# EAGLE design current (EAGLE 9.5.0)
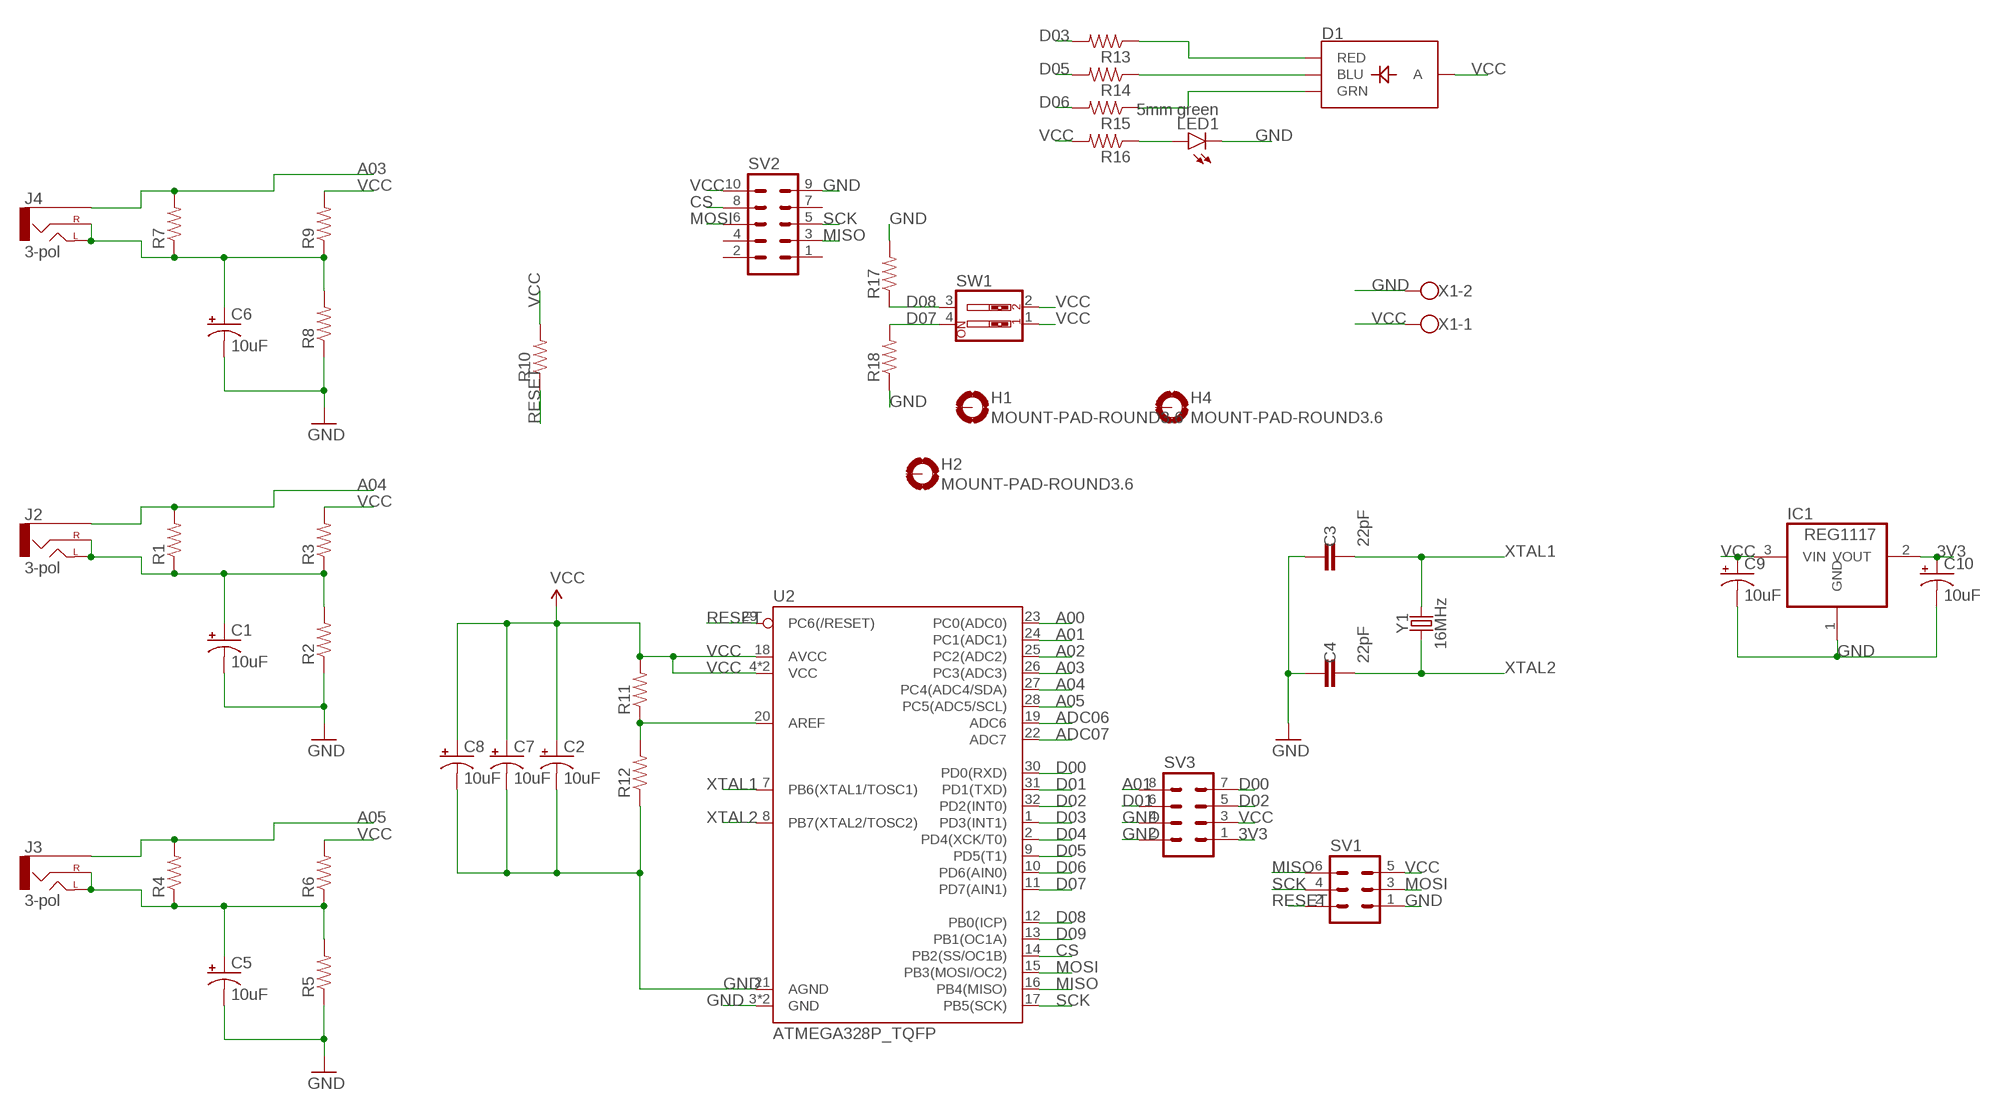
[diagram p0: schematic, sheet 1]

## Parts
C1  10uF  10UF-POLAR-EIA3216-16V-10%(TANT)  [EIA3216]
C2  10uF  10UF-POLAR-EIA3216-16V-10%(TANT)  [EIA3216]
C3  22pF  CAP-0805  [0805]
C4  22pF  CAP-0805  [0805]
C5  10uF  10UF-POLAR-EIA3216-16V-10%(TANT)  [EIA3216]
C6  10uF  10UF-POLAR-EIA3216-16V-10%(TANT)  [EIA3216]
C7  10uF  10UF-POLAR-EIA3216-16V-10%(TANT)  [EIA3216]
C8  10uF  10UF-POLAR-EIA3216-16V-10%(TANT)  [EIA3216]
C9  10uF  10UF-POLAR-EIA3216-16V-10%(TANT)  [EIA3216]
C10  10uF  10UF-POLAR-EIA3216-16V-10%(TANT)  [EIA3216]
D1  LED-RGB-CASMD  [LED-TRICOLOR-SMD]
H1  MOUNT-PAD-ROUND3.6  [3,6-PAD]
H2  MOUNT-PAD-ROUND3.6  [3,6-PAD]
H4  MOUNT-PAD-ROUND3.6  [3,6-PAD]
IC1  REG1117  [SOT223]
J2  3-pol  AUDIO-JACKPTH  [AUDIO-JACK]
J3  3-pol  AUDIO-JACKPTH  [AUDIO-JACK]
J4  3-pol  AUDIO-JACKPTH  [AUDIO-JACK]
LED1  5mm green  LEDCHIPLED_0805  [CHIPLED_0805]
R1  RESISTOR0805  [0805]
R2  RESISTOR0805  [0805]
R3  RESISTOR0805  [0805]
R4  RESISTOR0805  [0805]
R5  RESISTOR0805  [0805]
R6  RESISTOR0805  [0805]
R7  RESISTOR0805  [0805]
R8  RESISTOR0805  [0805]
R9  RESISTOR0805  [0805]
R10  RESISTOR0805  [0805]
R11  RESISTOR0805  [0805]
R12  RESISTOR0805  [0805]
R13  RESISTOR0805  [0805]
R14  RESISTOR0805  [0805]
R15  RESISTOR0805  [0805]
R16  RESISTOR0805  [0805]
R17  RESISTOR0805  [0805]
R18  RESISTOR0805  [0805]
SV1  MA03-2  [MA03-2]
SV2  MA05-2  [MA05-2]
SV3  MA04-2  [MA04-2]
SW1  SW_DIP-2  [EDG-02]
U2  ATMEGA328P_TQFP  [TQFP32-08]
X1  W237-102  [W237-102]
Y1  16MHz  CRYSTALSMD-3.2X2.5  [CRYSTAL-SMD-3.2X2.5MM]

## Nets
3V3: C10.+ IC1.2(VOUT) SV3.1
A00: U2.23(PC0(ADC0))
A01: SV3.8 U2.24(PC1(ADC1))
A02: U2.25(PC2(ADC2))
A03: J4.SLEEVE R7.2 U2.26(PC3(ADC3))
A04: J2.SLEEVE R1.2 U2.27(PC4(ADC4/SDA))
A05: J3.SLEEVE R4.2 U2.28(PC5(ADC5/SCL))
ADC06: U2.19(ADC6)
ADC07: U2.22(ADC7)
CS: SV2.8 U2.14(PB2(SS/OC1B))
D00: SV3.7 U2.30(PD0(RXD))
D01: SV3.6 U2.31(PD1(TXD))
D02: SV3.5 U2.32(PD2(INT0))
D03: R13.2 U2.1(PD3(INT1))
D04: U2.2(PD4(XCK/T0))
D05: R14.2 U2.9(PD5(T1))
D06: R15.2 U2.10(PD6(AIN0))
D07: R18.2 SW1.4 U2.11(PD7(AIN1))
D08: R17.1 SW1.3 U2.12(PB0(ICP))
D09: U2.13(PB1(OC1A))
GND: C1.- C2.- C3.1 C4.1 C5.- C6.- C7.- C8.- C9.- C10.- IC1.1(GND) LED1.C R2.1 R5.1 R8.1 R12.1 R17.2 R18.1 SV1.1 SV2.9 SV3.2 SV3.4 U2.3(GND) U2.5(GND) U2.21(AGND) X1.2
MISO: SV1.6 SV2.3 U2.16(PB4(MISO))
MOSI: SV1.3 SV2.6 U2.15(PB3(MOSI/OC2))
N$1: C5.+ J3.RING(RIGHT) J3.TIP(LEFT) R4.1 R5.2 R6.1
N$2: C1.+ J2.RING(RIGHT) J2.TIP(LEFT) R1.1 R2.2 R3.1
N$3: C6.+ J4.RING(RIGHT) J4.TIP(LEFT) R7.1 R8.2 R9.1
N$4: D1.R(RED) R13.1
N$5: R11.1 R12.2 U2.20(AREF)
N$6: D1.B(BLU) R14.1
N$7: D1.G(GRN) R15.1
N$8: LED1.A R16.1
RESET: R10.1 SV1.2 U2.29(PC6(/RESET))
SCK: SV1.4 SV2.5 U2.17(PB5(SCK))
VCC: C2.+ C7.+ C8.+ C9.+ D1.A IC1.3(VIN) R3.2 R6.2 R9.2 R10.2 R11.2 R16.2 SV1.5 SV2.10 SV3.3 SW1.1 SW1.2 U2.4(VCC) U2.6(VCC) U2.18(AVCC) X1.1
XTAL1: C3.2 U2.7(PB6(XTAL1/TOSC1)) Y1.3
XTAL2: C4.2 U2.8(PB7(XTAL2/TOSC2)) Y1.1
Unconnected: H1.B3,6(MOUNT) H2.B3,6(MOUNT) H4.B3,6(MOUNT) SV2.1 SV2.2 SV2.4 SV2.7

## Library data of the parts
C1 C2 C5-C10 = SparkFun-Capacitors:10UF-POLAR: 10.0µF polarized capacitors A capacitor is a passive two-terminal electrical component used to store electrical energy temporarily in an electric field.; PROD_ID: CAP-00811
C3 C4 = SparkFun-Capacitors:CAP
D1 = SparkFun-LED:LED-RGB-CA: LED-RGB Diffused Common Anode Packages: LED RGB-THRU P-LCC-4-3 LED-TRICOLOR-SMD SparkFun Products: RGB Diffused Common Anode- Diffuse <[https://www.sparkfun.com/products/10821]> RGB Diffused Common Anode - Clear <[https://www.sparkfun.com/products/10820]> Qduino Mini <[https://www.sparkfun.com/products/13614]> Triple Output LED RGB - SMD <https://www.sparkfun.com/products/7844>; PROD_ID: DIO-08324
H1 H2 H4 = holes:MOUNT-PAD-ROUND: MOUNTING PAD, round
IC1 = burr-brown:REG1117: 800mA and 1A Low Dropout (LDO) Positive Regulator 1.8V, 2.5V, 2.85V, 3.3V, 5V, and Adj; MPN: REG1117; OC_FARNELL: 1097566; OC_NEWARK: 14P6981
J2-J4 = SparkFun-Connectors:AUDIO-JACK: 3.5mm Audio Jack Simple 3.5mm common PCB mount audio jack. Variant PTH is our storefront SKU PRT-08032
LED1 = led:LED: LED OSRAM: - CHIPLED LG R971, LG N971, LY N971, LG Q971, LY Q971, LO R971, LY R971 LH N974, LH R974 LS Q976, LO Q976, LY Q976 LO Q996 - Hyper CHIPLED LW Q18S LB Q993, LB Q99A, LB R99A - SideLED LS A670, LO A670, LY A670, LG A670, LP A670 LB A673, LV A673, LT A673, LW A673 LH A674 LY A675 LS A676, LA A676, LO A676, LY A676, LW A676 LS A679, LY A679, LG A679 - Hyper Micro SIDELED® LS Y876, LA Y876, LO Y876, LY Y876 LT Y87S - SmartLED LW L88C, LW L88S LB L89C, LB L89S, LG L890 LS L89K, LO L89K, LY L89K LS L896, LA L896, LO L896, LY L896 - TOPLED LS T670, LO T670, LY T670, LG T670, LP T670 LSG T670, LSP T670, LSY T670, LOP T670, LYG T670 LG T671, LOG T671, LSG T671 LB T673, LV T673, LT T673, LW T673 LH T674 LS T676, LA T676, LO T676, LY T676, LB T676, LH T676, LSB T676, LW T676 LB T67C, LV T67C, LT T67C, LS T67K, LO T67K, LY T67K, LW E67C LS E67B, LA E67B, LO E67B, LY E67B, LB E67C, LV E67C, LT E67C LW T67C LS T679, LY T679, LG T679 LS T770, LO T770, LY T770, LG T770, LP T770 LB T773, LV T773, LT T773, LW T773 LH T774 LS E675, LA E675, LY E675, LS T675 LS T776, LA T776, LO T776, LY T776, LB T776 LHGB T686 LT T68C, LB T68C - Hyper Mini TOPLED® LB M676 - Mini TOPLED Santana® LG M470 LS M47K, LO M47K, LY M47K Source: http://www.osram.convergy.de LUXEON: - LUMILED® LXK2-PW12-R00, LXK2-PW12-S00, LXK2-PW14-U00, LXK2-PW14-V00 LXK2-PM12-R00, LXK2-PM12-S00, LXK2-PM14-U00 LXK2-PE12-Q00, LXK2-PE12-R00, LXK2-PE12-S00, LXK2-PE14-T00, LXK2-PE14-U00 LXK2-PB12-K00, LXK2-PB12-L00, LXK2-PB12-M00, LXK2-PB14-N00, LXK2-PB14-P00, LXK2-PB14-Q00 LXK2-PR12-L00, LXK2-PR12-M00, LXK2-PR14-Q00, LXK2-PR14-R00 LXK2-PD12-Q00, LXK2-PD12-R00, LXK2-PD12-S00 LXK2-PH12-R00, LXK2-PH12-S00 LXK2-PL12-P00, LXK2-PL12-Q00, LXK2-PL12-R00 Source: www.luxeon.com KINGBRIGHT: KA-3528ASYC Source: www.kingbright.com
R1-R18 = SparkFun-Resistors:RESISTOR: Generic Resistor Package
SV1 = con-lstb:MA03-2: PIN HEADER; OC_FARNELL: unknown; OC_NEWARK: unknown
SV2 = con-lstb:MA05-2: PIN HEADER; OC_FARNELL: unknown; OC_NEWARK: unknown
SV3 = con-lstb:MA04-2: PIN HEADER; OC_FARNELL: unknown; OC_NEWARK: unknown
SW1 = special:SW_DIP-2: DIP SWITCH
U2 = escape:ATMEGA328P_TQFP: Popular 328P in QFP Storefront component: ATmega328 - TQFP <https://www.sparkfun.com/products/13448> (COM-13448) Datasheet <http://www.sparkfun.com/datasheets/Components/SMD/ATMega328.pdf> SparkFun Products SparkFun RedBoard - Programmed with Arduino <https://www.sparkfun.com/products/12757> (DEV-12757) Arduino Pro Mini 328 - 5V/16MHz <https://www.sparkfun.com/products/11113> (DEV-11113) Arduino Pro Mini 328 - 3.3V/8MHz <https://www.sparkfun.com/products/11114> (DEV-11114) SparkFun OpenLog <https://www.sparkfun.com/products/13712> (DEV-13712) SparkFun MicroView - OLED Arduino Module <https://www.sparkfun.com/products/12923> (DEV-12923) SparkFun Digital Sandbox <https://www.sparkfun.com/products/12651> (DEV-12651) SparkFun PicoBoard <https://www.sparkfun.com/products/11888> (WIG-11888) Arduino Fio <https://www.sparkfun.com/products/10116> (DEV-10116) LilyPad Arduino 328 Main Board <https://www.sparkfun.com/products/13342> (DEV-13342) SparkFun RedStick <https://www.sparkfun.com/products/13741> (DEV-13741) LilyPad MP3 <https://www.sparkfun.com/products/11013> (DEV-11013) LilyPad Arduino SimpleSnap <https://www.sparkfun.com/products/10941> (DEV-10941) SparkFun Stepoko <https://www.sparkfun.com/products/13899> (ROB-13899) SparkFun Geiger Counter <https://www.sparkfun.com/products/11345> (SEN-11345) SparkFun EL Sequencer <https://www.sparkfun.com/products/12781> (COM-12781) Arduino Pro 328 - 5V/16MHz <https://www.sparkfun.com/products/10915> (DEV-10915) CryptoCape <https://www.sparkfun.com/products/12773> (DEV-12773) SparkFun IR Thermometer Evaluation Board - MLX90614 <https://www.sparkfun.com/products/10740> (SEN-10740) SparkFun RedBot Mainboard <https://www.sparkfun.com/products/12097> (ROB-12097) Arduino Pro 328 - 3.3V/8MHz <https://www.sparkfun.com/products/10914> (DEV-10914) SparkFun Block for Intel® Edison - Arduino <https://www.sparkfun.com/products/13036> (DEV-13036) SparkFun Simon Says - Surface Mount Soldering Kit <https://www.sparkfun.com/products/10935> (KIT-10935) SparkFun 7-Segment Serial Display - Red <https://www.sparkfun.com/products/11441> (COM-11441) SparkFun 7-Segment Serial Display - White <https://www.sparkfun.com/products/11629> (COM-11629) SparkFun 7-Segment Serial Display - Yellow <https://www.sparkfun.com/products/11443> (COM-11443) SparkFun 7-Segment Serial Display - Kelly Green <https://www.sparkfun.com/products/11440> (COM-11440) SparkFun 7-Segment Serial Display - Blue <https://www.sparkfun.com/products/11442> (COM-11442) SparkFun OpenSegment Serial Display - 20mm (Blue) <https://www.sparkfun.com/products/11647> (COM-11647) SparkFun OpenSegment Serial Display - 20mm (Green) <https://www.sparkfun.com/products/11646> (COM-11646) SparkFun OpenSegment Serial Display - 20mm (White) <https://www.sparkfun.com/products/11648> (COM-11648) SparkFun OpenSegment Serial Display - 20mm (Red) <https://www.sparkfun.com/products/11644> (COM-11644) SparkFun OpenSegment Serial Display - 20mm (Yellow) <https://www.sparkfun.com/products/11645> (COM-11645) SparkFun OpenSegment Shield <https://www.sparkfun.com/products/13190> (DEV-13190); PROD_ID: IC-09069
X1 = con-wago-500:W237-102: WAGO SCREW CLAMP; MPN: 237-102; OC_FARNELL: unknown; OC_NEWARK: 70K9898
Y1 = SparkFun-Clocks:CRYSTAL: Crystals (Generic) These are passive quartz crystals, which can be used as a clock source for a microcontroller. Crystal's are two-terminal devices. They require external "load" capacitors to generate an oscillating signal.

## Board
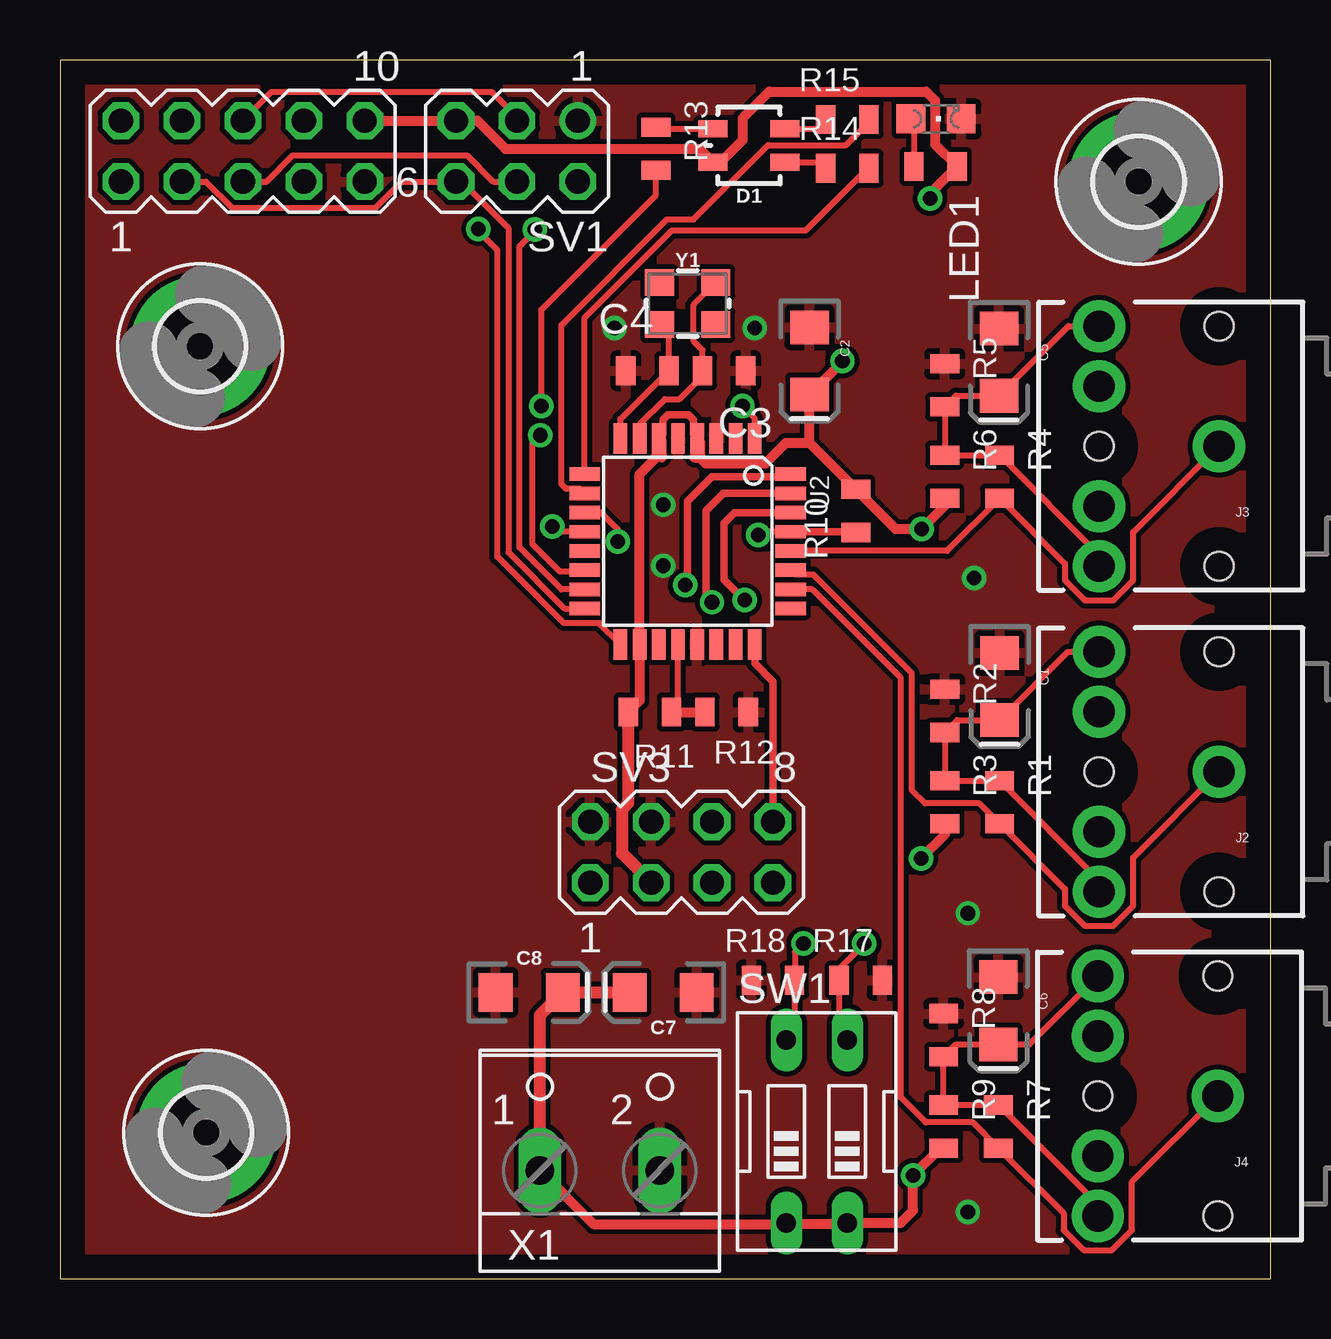
[diagram p1: board, top side]
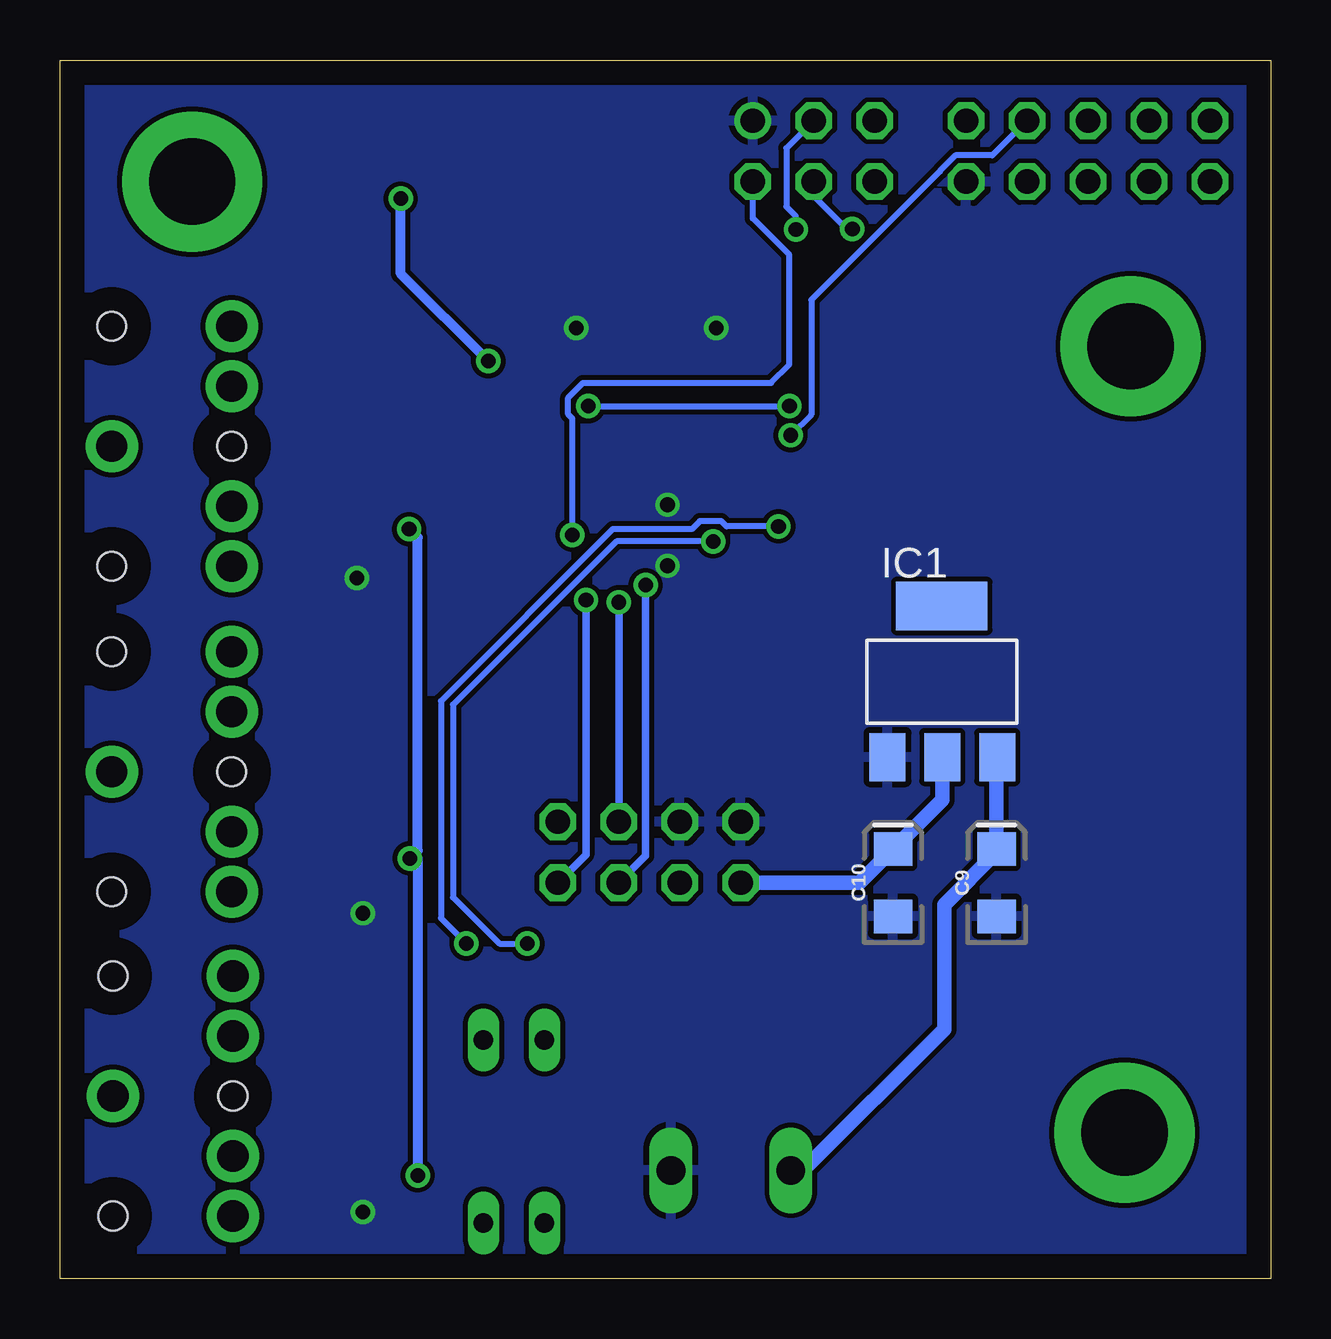
[diagram p2: board, bottom side, seen from below]

Size 50.47 x 50.79 mm. Coordinates in mm from the lower left corner, seen from the top.
Outline: 0,0 50.47,0 50.47,50.79 0,50.79 0,0
Copper layers (1*16): Top 0.035mm / dielectric 1.5mm / Bottom 0.035mm
Design rules "default": minimum track width 10mil, minimum drill 24mil, track to track 8mil, track to pad 8mil, pad to pad 8mil, via to via 8mil, smd to smd 8mil, copper to edge 40mil, drill to drill 8mil, minimum pad ring 10mil, minimum via ring 8mil, stop-mask expansion 4mil, vias tented up to drill 0mil, thermal gap 10mil

### Footprints (pad centres in the part's own frame; a part is rotated, then mirrored left to right if it is on the bottom)
EIA3216 = smd 1.4 x 1.6: + 1.4,0; - -1.4,0
0805 = smd 0.8 x 1.2: 1 -0.9,0; 2 0.9,0
LED-TRICOLOR-SMD = smd 1.2 x 0.7: A 1.5,0.7; B -1.5,0.7; G -1.5,-0.7; R 1.5,-0.7
3,6-PAD = drill 3.6 pad 5.842: B3,6 0,0
SOT223 = smd 1.499 x 2.007: 1 -2.261,-3.15; 2 0.025,-3.15; 3 2.311,-3.15 | smd 3.81 x 2.007: 4 0,3.15
AUDIO-JACK = drill 1.3 pad 2.184: RING 5,5; RSH 5,2.5; SLEEVE 0,0; TIP 5,-5; TSH 5,-2.5 | hole 1.2: 0,5; 0,-5; 5,0
CHIPLED_0805 = smd 1.2 x 1.2: A 0,-1.05; C 0,1.05
MA03-2 = drill 1.016: 1 -2.54,-1.27 | drill 1.016 octagon: 2 -2.54,1.27; 3 0,-1.27; 4 0,1.27; 5 2.54,-1.27; 6 2.54,1.27
MA05-2 = drill 1.016 octagon: 1 -5.08,-1.27; 2 -5.08,1.27; 3 -2.54,-1.27; 4 -2.54,1.27; 5 0,-1.27; 6 0,1.27; 7 2.54,-1.27; 8 2.54,1.27; 9 5.08,-1.27; 10 5.08,1.27
MA04-2 = drill 1.016 octagon: 1 -3.81,-1.27; 2 -3.81,1.27; 3 -1.27,-1.27; 4 -1.27,1.27; 5 1.27,-1.27; 6 1.27,1.27; 7 3.81,-1.27; 8 3.81,1.27
EDG-02 = drill 0.813 long: 1 -1.27,-3.81; 2 1.27,-3.81; 3 1.27,3.81; 4 -1.27,3.81
TQFP32-08 = smd 1.27 x 0.559: 1 -4.293,2.8; 2 -4.293,2; 3 -4.293,1.2; 4 -4.293,0.4; 5 -4.293,-0.4; 6 -4.293,-1.2; 7 -4.293,-2; 8 -4.293,-2.8; 17 4.293,-2.8; 18 4.293,-2; 19 4.293,-1.2; 20 4.293,-0.4; 21 4.293,0.4; 22 4.293,1.2; 23 4.293,2; 24 4.293,2.8 | smd 0.559 x 1.27: 9 -2.8,-4.293; 10 -2,-4.293; 11 -1.2,-4.293; 12 -0.4,-4.293; 13 0.4,-4.293; 14 1.2,-4.293; 15 2,-4.293; 16 2.8,-4.293; 25 2.8,4.293; 26 2,4.293; 27 1.2,4.293; 28 0.4,4.293; 29 -0.4,4.293; 30 -1.2,4.293; 31 -2,4.293; 32 -2.8,4.293
W237-102 = drill 1.194 long: 1 -2.5,-1.27; 2 2.5,-1.27
CRYSTAL-SMD-3.2X2.5MM = smd 1.2 x 1.1: 1 -1.175,-0.875; 2 1.175,-0.875; 3 1.175,0.875; 4 -1.175,0.875

### Placement (x,y rotation side)
C1  39.17,24.69 270 top
C2  31.24,38.25 270 top
C3  27.69,37.85 180 top
C4  24.49,37.85 0 top
C5  39.14,38.2 270 top
C6  39.12,11.18 270 top
C7  25.15,11.94 180 top
C8  19.56,11.94 0 top
C9  11.43,16.51 90 bottom
C10  15.75,16.51 90 bottom
D1  28.72,47.23 180 top
H1  44.96,45.72 0 top
H2  5.84,38.86 0 top
H4  6.1,6.1 0 top
IC1  13.72,24.89 0 bottom
J2  48.31,21.13 180 top
J3  48.31,34.7 180 top
J4  48.26,7.62 180 top
LED1  36.52,48.34 270 top
R1  39.17,19.86 270 top
R2  36.88,23.67 270 top
R3  36.88,19.86 270 top
R4  39.17,33.43 270 top
R5  36.88,37.24 270 top
R6  36.88,33.43 270 top
R7  39.12,6.35 270 top
R8  36.83,10.16 270 top
R9  36.83,6.35 270 top
R10  33.17,32 90 top
R11  24.59,23.62 180 top
R12  27.79,23.62 180 top
R13  24.84,47.09 270 top
R14  32.82,46.28 0 top
R15  32.82,48.31 0 top
R16  36.5,46.35 0 top
R17  33.38,12.45 0 top
R18  29.72,12.45 0 top
SV1  19.05,46.99 180 top
SV2  7.62,46.99 0 top
SV3  25.91,17.78 0 top
SW1  31.55,6.15 0 top
U2  26.16,30.73 270 top
X1  22.5,5.79 0 top
Y1  26.16,40.64 0 top

### Tracks (layer width: path | path; a pad name or v marks a point on that pad's centre or on a via)
3V3
  Bottom 0.61: IC1.2 13.69,19.97 C10.+ 17.15,16.51 SV3.1
A01
  Top 0.305: U2.24 28.96,25.65 29.72,24.89 SV3.8
A03
  Top 0.254: J4.SLEEVE 44.68,4.04 44.68,2.03 43.85,1.2 42.67,1.2 41.84,2.03 41.84,2.73 R7.2 38.05,6.52 36.09,6.52 35.05,7.56 35.05,25.04 31.36,28.73 U2.26
A04
  Top 0.254: J2.SLEEVE 44.73,17.55 44.73,15.54 43.9,14.71 42.72,14.71 41.89,15.54 41.89,16.24 R1.2 38.32,19.81 36.07,19.81 35.51,20.37 35.51,25.23 31.4,29.34 30.64,29.34 U2.27
A05
  Top 0.254: J3.SLEEVE 44.73,31.12 44.73,29.11 43.9,28.27 42.72,28.27 41.89,29.11 41.89,29.8 R4.2 36.97,30.33 U2.28
CS  (via drill 0.61)
  Top 0.254: U2.14 21.81,29.47 20.84,29.47 19.68,30.63 19.68,34.82 v20.02,35.15
  Bottom 0.254: SV2.8 11.61,46.81 13.15,46.81 13.79,46.17 13.79,46.15 19.15,40.79 19.15,36.02 v20.02,35.15
D00  (via drill 0.61)
  Top 0.305: U2.30 28.12,31.93 27.69,31.5 27.69,29.14 v28.54,28.29
  Bottom 0.305: v28.54,28.29 28.54,19.52 28.55,19.51 28.55,17.68 SV3.7
D01  (via drill 0.61)
  Top 0.305: U2.31 27.65,32.73 26.92,32 26.92,28.45 v27.18,28.19
  Bottom 0.305: 27.3,28.07 v27.18,28.19 SV3.6
D02  (via drill 0.61)
  Top 0.305: U2.32 30.35,33.43 27.18,33.43 26.16,32.41 26.16,28.96 26.11,28.91 v26.06,28.91
  Bottom 0.305: SV3.5 26.06,17.63 v26.06,28.91
D03  (via drill 0.61)
  Top 0.254: U2.1 28.96,35.86 v28.45,36.37 | v20.07,36.37 20.07,40.39 24.84,45.16 R13.2
  Bottom 0.254: v28.45,36.37 v20.07,36.37
D05
  Top 0.254: U2.9 21.87,40.06 25.5,43.69 31.09,43.69 33.68,46.28 R14.2
D06
  Top 0.254: U2.10 21.68,32.92 21.1,32.92 20.9,33.12 20.9,39.75 25.3,44.15 26.42,44.15 29.52,47.24 32.77,47.24 33.72,48.2 R15.2
D07  (via drill 0.61)
  Top 0.254: SW1.4 30.62,10.3 R18.2 30.63,12.46 30.63,13.61 v30.99,13.97 | U2.11 22.56,31.93 23.25,31.24 v23.25,30.73
  Bottom 0.254: v23.25,30.73 27.28,30.73 34.09,23.93 34.09,15.9 32.16,13.97 v30.99,13.97
D08  (via drill 0.61)
  Top 0.254: SW1.3 32.48,10.3 R17.1 32.48,12.9 33.33,13.75 33.33,13.77 v33.53,13.97 | U2.12 20.75,31.13 v20.52,31.36
  Bottom 0.254: v20.52,31.36 22.69,31.36 22.9,31.57 23.8,31.57 24.13,31.24 27.43,31.24 34.59,24.08 34.59,15.04 v33.53,13.97
GND  (via drill 0.61)
  other vias: 37.85,2.79 37.85,15.24 38.1,29.21 25.15,32.26 25.15,29.72 23.11,39.62 28.96,39.62
  pour Bottom: 0,50.8 50.55,50.8 50.55,0 0,0
  pour Top: 0,50.8 50.55,50.8 50.55,0 0,0
MISO
  Top 0.254: SV2.3 6.08,45.72 7.17,44.63 13.15,44.63 14.24,45.72 SV1.6 16.76,45.72 18.69,43.79 18.69,30.28 21.04,27.93 U2.16
MOSI  (via drill 0.61)
  Top 0.254: SV2.6 8.82,49.46 18,49.46 19.05,48.41 SV1.3 | U2.15 20.9,28.73 19.15,30.48 19.15,43.03 19.8,43.67 v19.8,43.72
  Bottom 0.254: v19.8,43.72 19.8,44.28 20.19,44.68 20.19,47.12 SV1.3
N$1
  Top 0.254: J3.RING 43.31,30.18 R4.1 R6.1 R5.2 37.35,36.8 C5.+ 42.04,39.7 J3.TIP
N$2
  Top 0.254: J2.TIP 42.01,26.13 C1.+ 37.4,23.29 R2.2 R3.1 R1.1 43.31,16.62 J2.RING
N$3
  Top 0.254: J4.RING 43.26,3.11 R7.1 R9.1 R8.2 37.35,9.78 C6.+ 40.42,9.78 J4.TIP
N$4
  Top 0.254: R13.1 24.91,47.93 D1.R
N$5
  Top 0.254: R11.1 25.76,23.9 U2.20
  Top 0.406: R11.1 R12.2
N$6
  Top 0.254: D1.B 31.67,46.53 R14.1
N$7
  Top 0.254: D1.G 31.53,47.93 R15.1
N$8
  Top 0.254: LED1.A 35.6,48.2 R16.1
RESET  (via drill 0.61)
  Top 0.254: U2.29 29.24,31.13 v29.11,31
  Top 0.305: U2.29 33.14,31.13 R10.1
  Bottom 0.254: v29.11,31 29.11,35.85 29.29,36.03 29.29,36.72 28.67,37.34 20.83,37.34 20.07,38.1 20.07,42.67 21.59,44.2 SV1.2
SCK  (via drill 0.61)
  Top 0.254: SV2.5 8.62,45.72 9.71,46.81 16.96,46.81 18.05,45.72 SV1.4 | U2.17 22.48,27.32 21,27.32 18.24,30.09 18.24,42.86 17.44,43.65 v17.44,43.76
  Bottom 0.254: v17.44,43.76 17.7,43.76 19.05,45.11 SV1.4
VCC  (via drill 0.61)
  Top 0.305: U2.6 25.13,35.19 25.13,35.81 25.34,36.02 26.19,36.02 26.4,35.81 26.4,35.19 U2.4
  Top 0.406: SV2.10 SV1.5 17.4,48.26 18.57,47.09 26.65,47.09 D1.A 27.53,46.53 28.45,47.45 28.45,48.36 29.56,49.47 36.11,49.47 36.47,49.1 36.47,47.28 R16.2 36.27,45.22 v36.27,45.02 | X1.1 22.24,2.29 30.28,2.29 | 30.28,2.29 SW1.1 | 30.28,2.29 32.77,2.29 SW1.2 35.05,2.34 35.56,2.85 v35.56,4.32 36.69,5.45 R9.2 | R6.2 36.88,32.21 v35.92,31.24 34.83,31.24 R10.2 31.24,34.83 | v35.89,17.53 36.88,18.52 R3.2 | 31.24,34.83 C2.+ 32.61,38.22 v32.61,38.24 | 26.68,34.22 26.91,33.98 29.41,33.98 30.26,34.83 31.24,34.83 | U2.4 26.68,34.91 26.68,34.22 | U2.6 25.08,34.91 25.08,34.54 | 25.08,34.54 25.08,34.22 | 26.45,34.22 26.68,34.22 | 25.08,34.54 24.85,34.32 24.85,34.22 24.16,33.54 U2.18 24.16,24.1 R11.2
  Top 0.508: X1.1 20,10.98 C8.+ C7.+ | SV3.3 23.42,17.73 23.42,19.55 23.69,19.82 R11.2
  Bottom 0.406: v35.56,4.32 35.56,17.53 v35.89,17.53 35.56,17.86 35.56,30.89 v35.92,31.24 | v32.61,38.24 36.27,41.89 v36.27,45.02
  Bottom 0.61: IC1.3 11.43,21.72 C9.+ 11.43,17.78 13.61,15.6 13.61,10.41 19.51,4.52 X1.1
XTAL1
  Top 0.254: U2.7 24.16,35.61 25.22,36.66 25.82,36.66 26.78,37.62 26.78,37.84 C3.2 26.79,38.7 26.41,39.08 26.41,40.59 Y1.3
XTAL2
  Top 0.254: U2.8 23.36,35.82 C4.2 25.39,39.37 Y1.1